# EAGLE design oven (EAGLE 6.1)
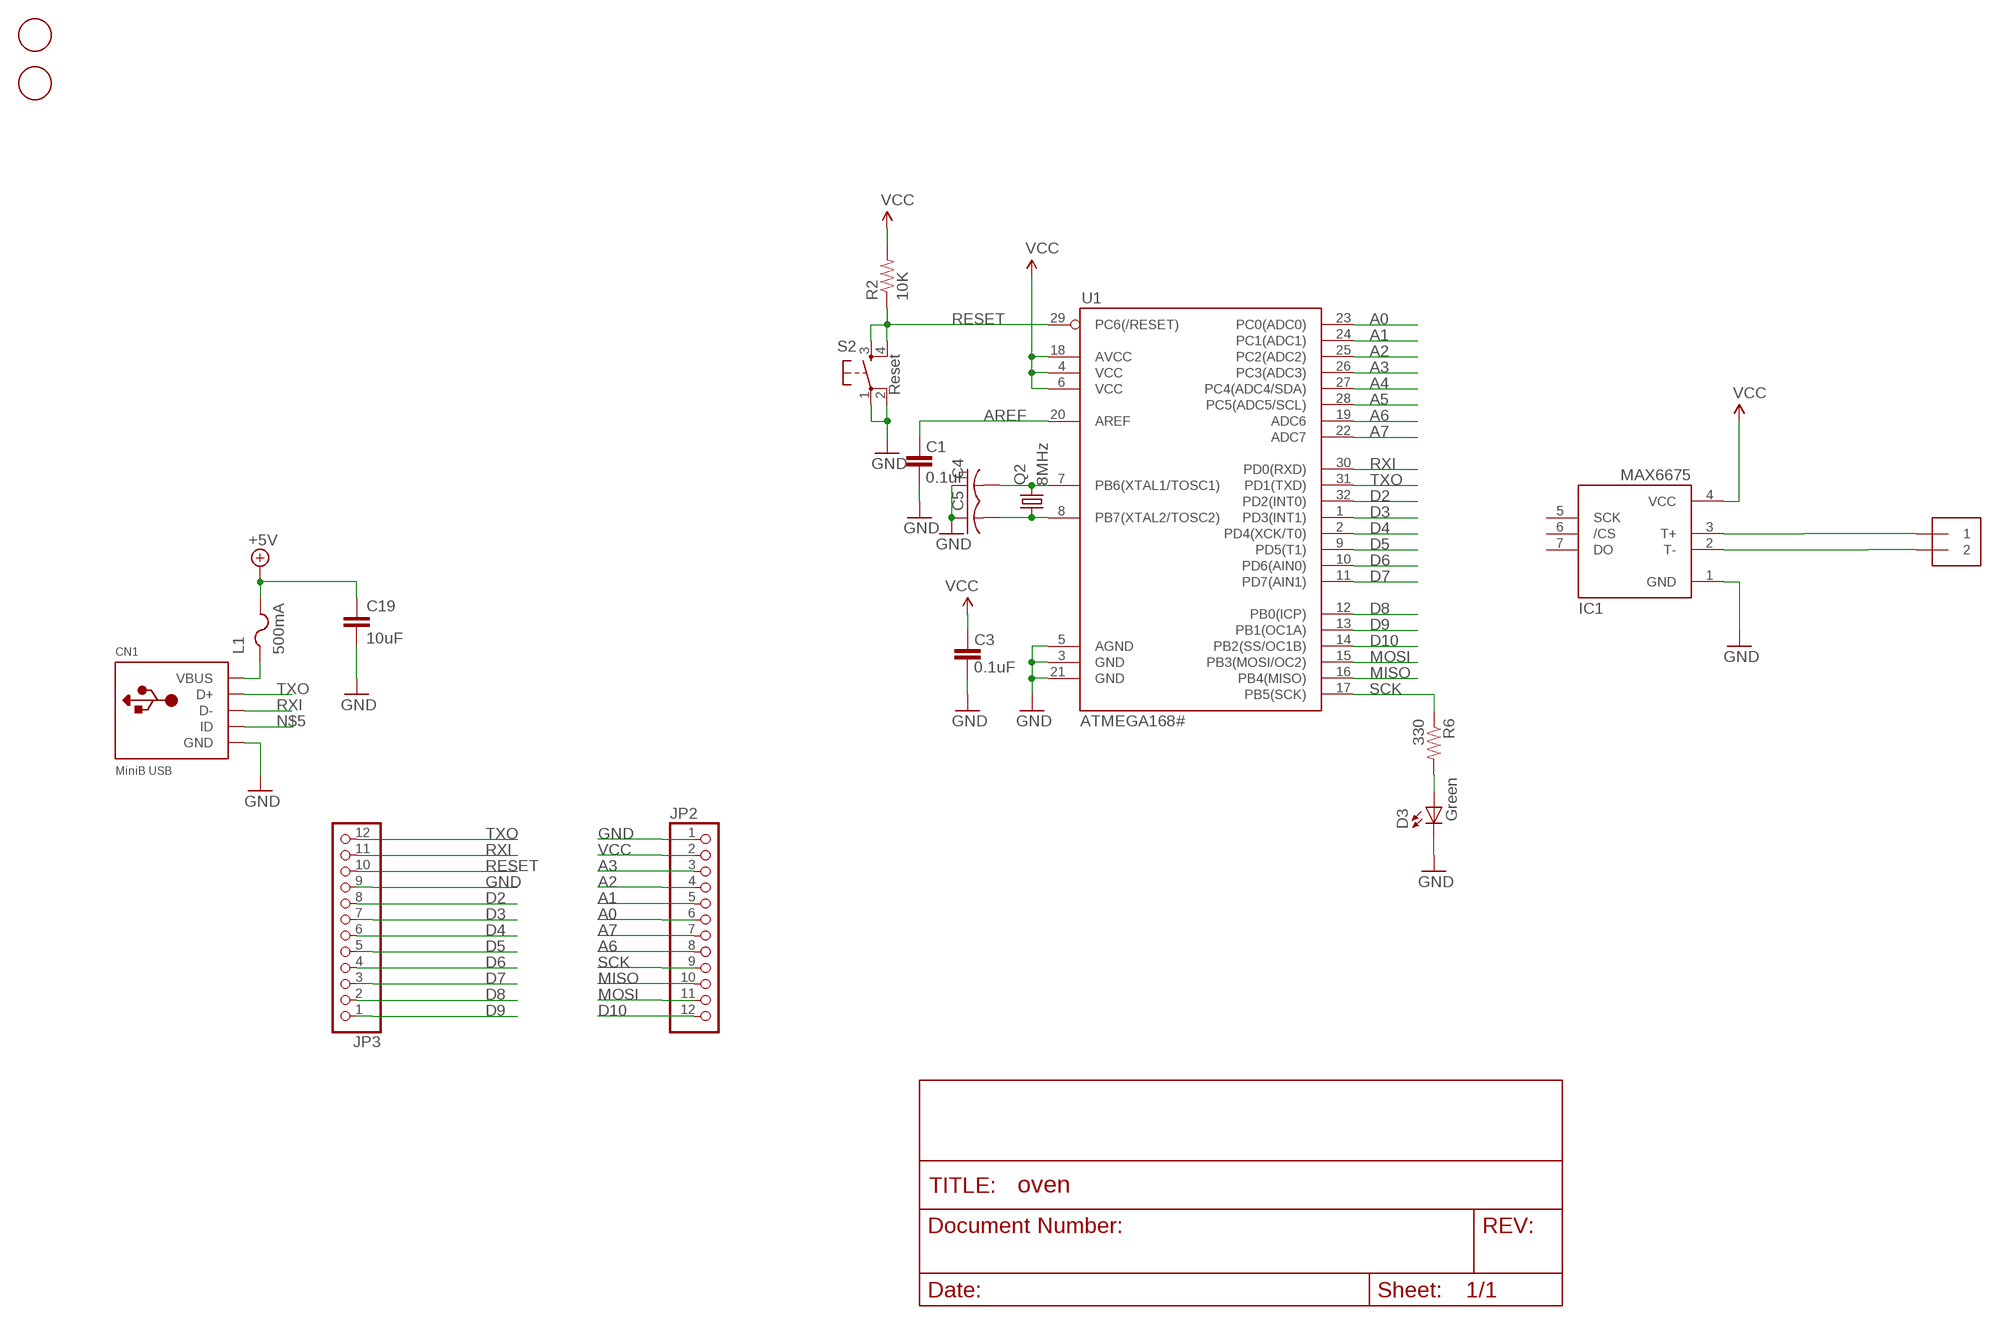
[diagram p0: schematic, sheet 1]

## Parts
C1  0.1uF  CAP0805  [0805]
C3  0.1uF  CAP0805  [0805]
C4  C-USC0805  [C0805]
C5  C-USC0805  [C0805]
C19  10uF  C-EUC1206  [C1206]
CN1  MiniB USB  USBMINIB  [USB-MINIB]
D3  Green  LED0603  [LED-0603]
IC1  MAX6675  [SO08]
J1  1X2-3.5MM  [3.5MMTERM]
JP2  PINHD-1X12  [1X12]
JP3  PINHD-1X12  [1X12]
L1  500mA  PTCFUSE-1206  [R1206]
Q2  8MHz  CRYSTALCTS406  [CTS406]
R2  10K  RESISTOR  [0805]
R6  330  RESISTOR  [0805]
S2  Reset  TAC_SWITCHSMD  [TACTILE_SWITCH_SMD]
U1  ATMEGA168#  ATMEGA168  [TQFP32-08]
U$5  FIDUCIAL  [FIDUCIAL_1MM]
U$6  FIDUCIAL  [FIDUCIAL_1MM]

## Nets
3.3V: IC1.4(VCC) ; supply symbol labelled VCC
A0: JP2.6 U1.23(PC0(ADC0))
A1: JP2.5 U1.24(PC1(ADC1))
A2: JP2.4 U1.25(PC2(ADC2))
A3: JP2.3 U1.26(PC3(ADC3))
A4: U1.27(PC4(ADC4/SDA))
A5: U1.28(PC5(ADC5/SCL))
A6: JP2.8 U1.19(ADC6)
A7: JP2.7 U1.22(ADC7)
AREF: C1.2 U1.20(AREF)
D2: JP3.8 U1.32(PD2(INT0))
D3: JP3.7 U1.1(PD3(INT1))
D4: JP3.6 U1.2(PD4(XCK/T0))
D5: JP3.5 U1.9(PD5(T1))
D6: JP3.4 U1.10(PD6(AIN0))
D7: JP3.3 U1.11(PD7(AIN1))
D8: JP3.2 U1.12(PB0(ICP))
D9: JP3.1 U1.13(PB1(OC1A))
D10: JP2.12 U1.14(PB2(SS/OC1B))
GND: C1.1 C3.1 C4.1 C5.1 C19.2 CN1.GND D3.C IC1.1(GND) JP2.1 JP3.9 S2.1 S2.2 U1.3(GND) U1.5(AGND) U1.21(GND)
GND1: IC1.2(T-) J1.2
MISO: JP2.10 U1.16(PB4(MISO))
MOSI: JP2.11 U1.15(PB3(MOSI/OC2))
N$1: C5.2 Q2.1 U1.8(PB7(XTAL2/TOSC2))
N$2: IC1.3(T+) J1.1
N$3: C4.2 Q2.3 U1.7(PB6(XTAL1/TOSC1))
N$5: CN1.ID
N$7: D3.A R6.2
RESET: JP3.10 R2.1 S2.3 S2.4 U1.29(PC6(/RESET))
RXI: CN1.D- JP3.11 U1.30(PD0(RXD))
SCK: JP2.9 R6.1 U1.17(PB5(SCK))
TXO: CN1.D+ JP3.12 U1.31(PD1(TXD))
VBUS: CN1.VBUS L1.1
VCC: C3.2 C19.1 JP2.2 L1.2 R2.2 U1.4(VCC) U1.6(VCC) U1.18(AVCC) ; supply symbol labelled +5V
Unconnected: IC1.5(SCK) IC1.6(/CS) IC1.7(DO)

## Library data of the parts
C1 C3 = SparkFun:CAP: Capacitor Standard 0603 ceramic capacitor, and 0.1" leaded capacitor.
C4 C5 = rcl:C-US: CAPACITOR, American symbol
C19 = rcl:C-EU: CAPACITOR, European symbol
CN1 = adafruit:USB: USB Connectors USBMINIB - Surface Mount Female Mini-B USB Connector 4UConnector: 06564 By microbuilder.eu Thru-hole RA Female Mini-B USB Connector 4UConnector: 18732 By ladyada.net
D3 = SparkFun:LED: LEDs Standard schematic elements and footprints for 5mm, 3mm, 1206, and 0603 sized LEDs. 5mm - Spark Fun Electronics SKU : COM-00529 (and others)
IC1 = adafruit:MAX6675
J1 = adafruit:1X2: 3.5mm Terminal block http://www.ladyada.net/library/pcb/eaglelibrary.html
JP2 JP3 = pinhead:PINHD-1X12: PIN HEADER
L1 = adafruit:PTCFUSE: PTC fuses, resettable thermistors
Q2 = crystal:CRYSTAL: CRYSTAL; OC_FARNELL: unknown; OC_NEWARK: unknown
R2 R6 = SparkFun:RESISTOR: Resistor Basic schematic elements and footprints for 0603, 1206, and PTH 1/10th watt (small) resistors.
S2 = SparkFun:TAC_SWITCH: Momentary Switch Button commonly used for reset or general input. Spark Fun Electronics SKU : COM-00097
U1 = SparkFun:ATMEGA168
U$5 U$6 = adafruit:FIDUCIAL: For use by pick and place machines to calibrate the vision/machine, 1mm By microbuilder.eu

## Net classes
1 vcc: width 0.254 mm

## Board
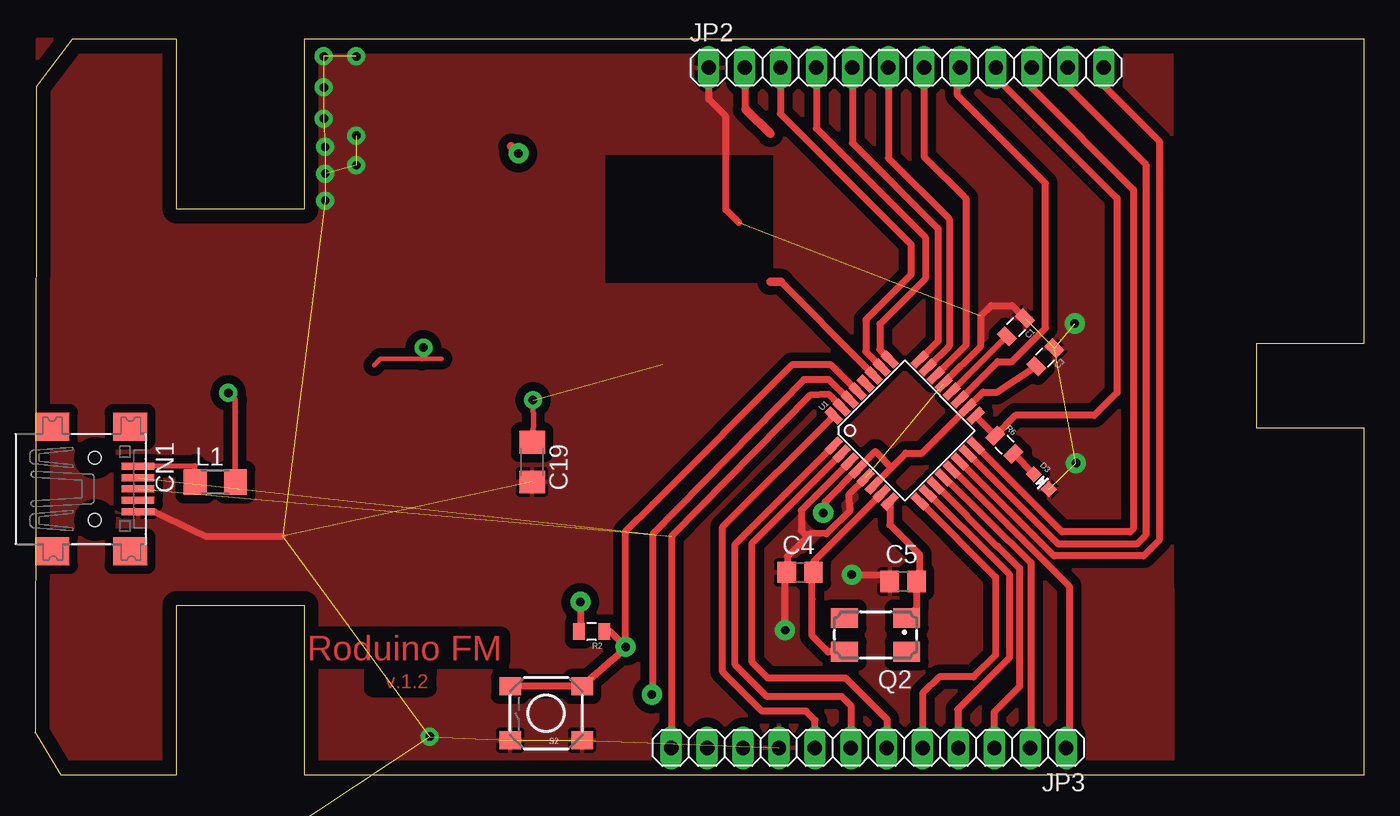
[diagram p1: board, top side]
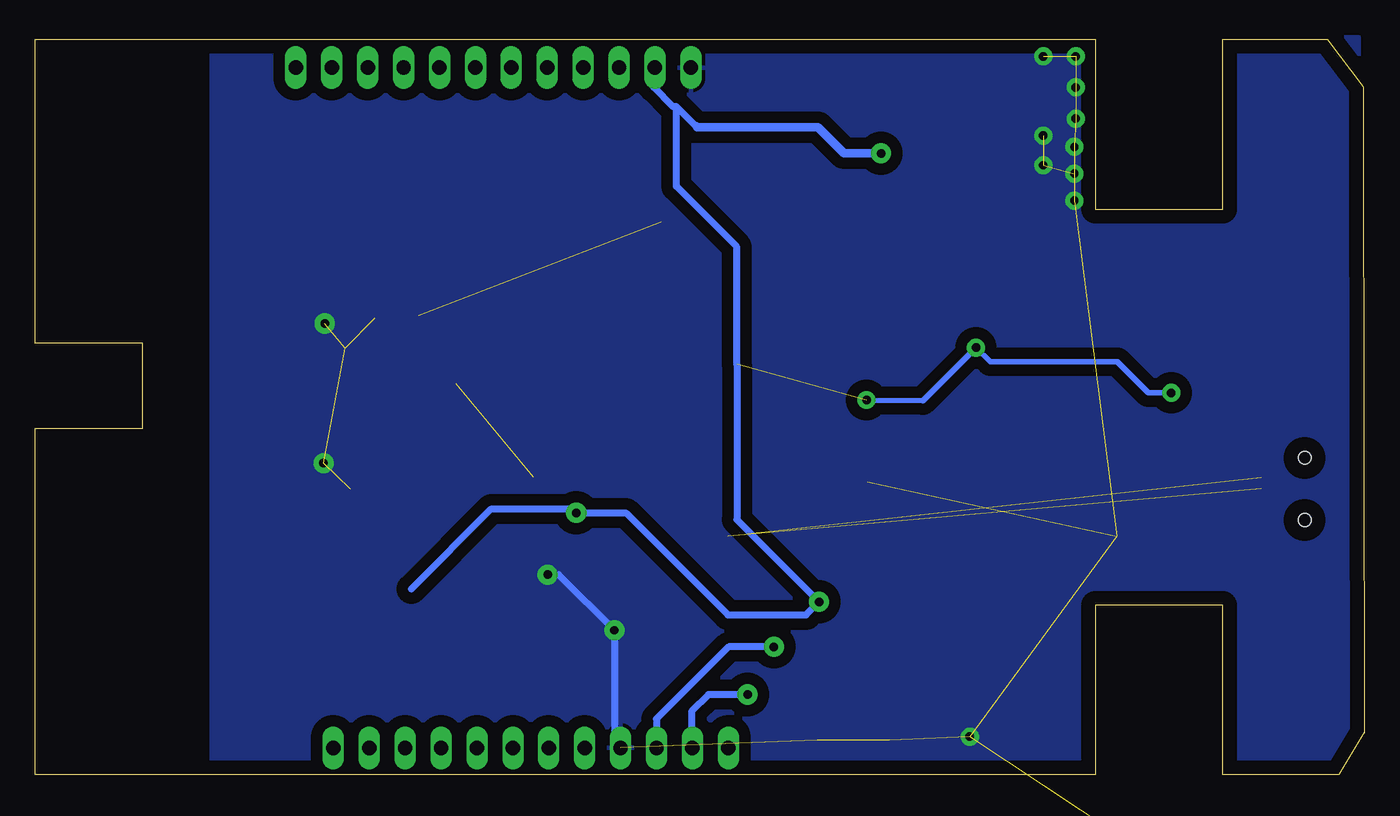
[diagram p2: board, bottom side, seen from below]

Size 94 x 52 mm. Coordinates in mm from the lower left corner, seen from the top.
Outline: 0,3 0.05,45.85 0.05,48.65 2.6,52 10,52 10,40 19,40 19,52 94,52 94,30.5 86.4,30.5 86.4,24.5 94,24.5 94,21.5 94,0 19,0 19,12 10,12 10,0 1.8,0 0,3
Outline: 0,3 0,2.95 0,3
Copper layers (1*16): Top 0.035mm / dielectric 1.5mm / Bottom 0.035mm
Design rules: minimum track width 10mil, minimum drill 24mil, track to track 8mil, track to pad 8mil, pad to pad 8mil, via to via 8mil, smd to smd 8mil, copper to edge 40mil, drill to drill 8mil, minimum pad ring 10mil, minimum via ring 8mil, stop-mask expansion 4mil, vias tented up to drill 0mil, thermal gap 10mil

### Footprints (pad centres in the part's own frame; a part is rotated, then mirrored left to right if it is on the bottom)
0805 = smd 0.8 x 1.2: 1 -0.9,0; 2 0.9,0
C0805 = smd 1.3 x 1.5: 1 -0.95,0; 2 0.95,0
C1206 = smd 1.6 x 1.8: 1 -1.4,0; 2 1.4,0
USB-MINIB = smd 0.5 x 2.308: D+ 0,4.064; D- -0.8,4.064; GND 1.6,4.064; ID 0.8,4.064; VBUS -1.6,4.064 | smd 2 x 2.4: GND1 -4.4,-2; GND2 -4.4,3.5; GND3 4.4,3.5; GND4 4.4,-2 | hole 0.9: -2.2,1; 2.2,1
LED-0603 = smd 0.8 x 0.8: A 0,-0.75; C 0,0.75
SO08 = smd 0.66 x 2.032: 1 -1.905,-3.073; 2 -0.635,-3.073; 3 0.635,-3.073; 4 1.905,-3.073; 5 1.905,3.073; 6 0.635,3.073; 7 -0.635,3.073; 8 -1.905,3.073
3.5MMTERM = drill 1 pad 2.184: 1 1.8,0; 2 -1.7,0
1X12 = drill 1.016 long: 1 -13.97,0; 2 -11.43,0; 3 -8.89,0; 4 -6.35,0; 5 -3.81,0; 6 -1.27,0; 7 1.27,0; 8 3.81,0; 9 6.35,0; 10 8.89,0; 11 11.43,0; 12 13.97,0
R1206 = smd 1.6 x 1.803: 1 -1.422,0; 2 1.422,0
CTS406 = smd 1.9 x 1.4: 1 -2.2,-1.2; 2 2.2,-1.2; 3 2.2,1.2; 4 -2.2,1.2
TACTILE_SWITCH_SMD = smd 1.524 x 1.27: 1 -2.54,1.905; 2 2.54,1.905; 3 -2.54,-1.905; 4 2.54,-1.905
TQFP32-08 = smd 1.27 x 0.559: 1 -4.293,2.8; 2 -4.293,2; 3 -4.293,1.2; 4 -4.293,0.4; 5 -4.293,-0.4; 6 -4.293,-1.2; 7 -4.293,-2; 8 -4.293,-2.8; 17 4.293,-2.8; 18 4.293,-2; 19 4.293,-1.2; 20 4.293,-0.4; 21 4.293,0.4; 22 4.293,1.2; 23 4.293,2; 24 4.293,2.8 | smd 0.559 x 1.27: 9 -2.8,-4.293; 10 -2,-4.293; 11 -1.2,-4.293; 12 -0.4,-4.293; 13 0.4,-4.293; 14 1.2,-4.293; 15 2,-4.293; 16 2.8,-4.293; 25 2.8,4.293; 26 2,4.293; 27 1.2,4.293; 28 0.4,4.293; 29 -0.4,4.293; 30 -1.2,4.293; 31 -2,4.293; 32 -2.8,4.293
FIDUCIAL_1MM = smd 1 x 1: 1 0,0

### Placement (x,y rotation side)
C1  69.37,31.65 225 top
C3  71.45,29.51 225 top
C4  54.1,14.31 0 top
C5  61.39,13.67 0 top
C19  35.14,22.11 270 top
CN1  3.2,20.21 270 top
D3  71.16,20.72 225 top
IC1  1,-13.3 0 top  (outside the outline)
J1  -0.15,-25.2 0 top  (outside the outline)
JP2  61.6,50 0 top
JP3  58.95,1.9 180 top
L1  12.73,20.69 0 top
Q2  59.44,9.89 180 top
R2  39.35,10.13 180 top
R6  68.56,23.35 315 top
S2  36.14,4.35 180 top
U1  61.5,24.34 45 top
U$5  -2.55,-18.6 0 top  (outside the outline)
U$6  -0.4,-18.6 0 top  (outside the outline)

### Tracks (layer width: path | path; a pad name or v marks a point on that pad's centre or on a via)
A0
  Top 0.508: U1.23 64.65,30.32 64.65,39.3 60.33,43.62 JP2.6
A1
  Top 0.508: U1.24 63.86,30.66 63.86,38.62 57.79,44.69 JP2.5
A2
  Top 0.508: U1.25 59.75,30.06 59.75,31.86 62.95,35.06 62.95,38.01 55.25,45.7 55.25,45.71 JP2.4
A3
  Top 0.508: U1.26 58.76,29.92 58.76,32.16 61.96,35.37 61.96,37.5 52.71,46.75 JP2.3
A4
  Top 0.5: U1.27 58.56,28.99 52.75,34.85
  Top 0.61: 52.75,34.85 51.99,34.85
A6
  Top 0.508: U1.19 68.08,29.22 69.09,29.22 71.45,31.58 71.45,41.82 65.23,48.04 65.23,49.84 65.25,49.84 JP2.8
A7
  Top 0.508: U1.22 65.82,30.36 65.82,40.75 62.87,43.7 JP2.7
AREF
  Top 0.406: 64.82,27.13 64.85,27.13 C1.2
  Top 0.508: U1.20 64.82,27.13
D2
  Top 0.406: 55.14,3.84 55.16,3.86
  Top 0.508: 55.16,3.86 54.51,4.5 51.39,4.5 48.62,7.27 48.62,17.53 U1.32 | JP3.8 55.14,3.84
D3
  Top 0.508: U1.1 49.51,16.31 49.51,7.78 51.77,5.52 57.05,5.52 57.7,4.87 57.7,1.92 JP3.7
D4
  Top 0.508: U1.2 50.7,16.37 50.7,7.96 51.82,6.84 57.33,6.84 60.24,3.93 60.24,1.92 JP3.6
D5
  Top 0.508: U1.9 62.58,19.33 67.92,13.98 67.92,8.47 66.38,6.92 63.94,6.92 62.77,5.75 JP3.5
D6
  Top 0.508: U1.10 63.15,19.89 65.51,17.53 65.54,17.53 68.89,14.18 68.89,8.26 65.26,4.63 65.26,1.94 JP3.4
D7
  Top 0.508: U1.11 63.73,20.46 68.05,16.14 68.1,16.14 69.63,14.61 69.63,6.23 67.82,4.43 67.82,1.92 JP3.3
D8
  Top 0.508: U1.12 64.31,21.02 70.44,14.99 70.44,1.96 JP3.2
D9
  Top 0.508: U1.13 64.89,21.59 73.13,13.34 73.13,2.11 JP3.1
D10
  Top 0.508: U1.14 72.06,15.48 78.42,15.48 79.51,16.57 79.51,44.81 75.57,48.75 JP2.12
GND  (via drill 0.6 pad 1.27, 0.6 pad 1.42)  (21 unrouted)
  Top 0.5: 49.75,39.05 48.85,39.95 | CN1.GND 8.44,18.61 12.05,16.85 17.49,16.85
  Top 0.508: U1.5 58.75,20.98 58.72,20.98 57.54,19.8 57.61,18.68 55.96,17.03 54.84,17.08 54.6,16.84 | 54.6,16.84 53.19,15.43 53.19,14.36 C4.1 53.04,14.21 v53.04,10.22 | U1.3 57.62,22.14 54.18,18.7 54.18,17.25 54.6,16.84 | U1.21 64.25,27.68 66.88,30.31 66.88,32.44 67.62,33.18 69.11,33.18 C1.1 | v57.77,14.16 59.95,14.16 C5.1 | 48.85,39.95 48.85,46.55 47.65,47.75 47.65,49.98 JP2.1
  Bottom 0.508: v57.77,14.16 56.98,14.16 v53.04,10.22 53.04,2.34 JP3.9
  other vias: 73.61,22.03 73.53,31.91 20.4,50.8 20.4,48.6 20.4,46.4 20.5,44.4 20.5,42.5 20.5,40.6 22.7,50.8 22.7,45.2 22.7,43.1 27.9,2.7
  pour Bottom (isolate 0.813): 0.38,52.16 0.38,0.38 10.05,0.38 10.05,12 18.95,12 18.95,0.2 81.52,0.23 81.51,52.01 19.05,52.05 19.05,40.25 18.95,40.25 18.95,40.05 10.05,40.05 10.05,52.16
  pour Top (isolate 0.61): 0.18,51.96 0.38,0.38 10.05,0.38 10.05,12.1 18.95,12.1 18.95,0.25 80.44,0.33 80.36,51.99 40.35,52.1 40.35,44.7 40.3,44.7 40.3,44 52.35,44 52.35,34.85 52.4,34.85 52.4,34.6 40.15,34.6 40.15,52.05 18.95,52.05 18.95,40.1 10.05,40.1 10.05,51.96
GND1  (1 unrouted)
MISO
  Top 0.508: U1.16 72.62,17.18 77.45,17.18 77.68,17.41 77.68,41.38 70.49,48.57 70.49,48.58 JP2.10
MOSI
  Top 0.508: U1.15 72.36,16.32 77.93,16.32 78.54,16.92 78.54,43.16 73.03,48.68 JP2.11
N$1
  Top 0.508: U1.8 60.45,17.67 62.54,15.58 62.54,13.87 C5.2 62.34,11.79 Q2.1
N$2  (1 unrouted)
N$3
  Top 0.508: Q2.3 56.07,8.69 54.95,9.81 54.95,12.43 54.95,14.21 C4.2 55.05,15.06 U1.7
N$7
  Top 0.508: R6.2 69.22,22.71 D3.A
RESET  (via drill 0.6 pad 1.42)
  Top 0.508: S2.4 S2.3 41.83,8.99 v41.76,9.05 | U1.29 56.29,28.99 53.52,28.99 43.64,19.11 41.76,17.23 v41.76,9.05 | R2.1 40.68,10.13 v41.76,9.05
  Bottom 0.508: v41.76,9.05 44.96,9.05 50.07,3.94 JP3.10
RXI  (via drill 0.6 pad 1.42)  (1 unrouted)
  Top 0.508: U1.30 57.58,26.53 56.14,27.95 54.36,27.95 43.67,17 43.67,5.72 v43.62,5.67
  Bottom 0.508: v43.62,5.67 46.38,5.67 47.58,4.48 47.58,1.96 JP3.11
SCK
  Top 0.508: U1.17 66.52,25.39 R6.1 69.34,25.41 74.91,25.41 76.51,27.01 76.51,40.77 67.95,49.34 JP2.9
TXO  (1 unrouted)
  Top 0.508: U1.31 56.14,26.91 54.79,26.83 45.01,16.87 45.01,1.93 JP3.12
VBUS
  Top 0.406: CN1.VBUS 11.29,21.86 L1.1
VCC  (via drill 0.6 pad 1.27, 0.6 pad 1.42)  (1 unrouted)
  Top 0.305: 23.97,28.97 24.4,29.4 27.35,29.4 28.75,29.4
  Top 0.406: L1.2 14.15,26.5 v13.65,27 | v27.45,30.2 27.45,29.5 27.35,29.4 | C19.1 35.24,24.76 v35.2,26.5
  Top 0.5: 33.85,43.62 v34.17,43.94
  Top 0.508: C3.2 68.03,27.06 67.04,27.06 65.95,25.97 U1.18 62.73,22.74 61.58,22.74 59.31,20.48 U1.6 60.56,21.7 60.56,21.73 59.42,22.87 58.18,21.64 U1.4 58.16,21.59 55.88,19.31 55.88,18.68 v55.73,18.52 | v38.56,12.22 38.56,10.24 R2.2 | 50.25,47.05 50.25,49.92 JP2.2
  Top 0.61: 33.67,44.44 v34.17,43.94 | 51.99,45.31 50.25,47.05
  Bottom 0.406: v13.65,27 15.25,27 17.45,29.2 26.45,29.2 v27.45,30.2 31.2,26.45 v35.2,26.5
  Bottom 0.5: 67.4,13.15 61.75,18.8 56.01,18.8 v55.73,18.52
  Bottom 0.508: v55.73,18.52 52.23,18.52 45.01,11.31 39.48,11.31 v38.56,12.22 44.38,18.04 44.38,29.02 44.38,37.33 48.65,41.6 48.65,47.25 | 47.2,45.8 47.2,45.9 47.3,45.9 48.65,47.25 | 50.2,49.97 JP2.2 50.25,49.92 50.25,48.6 48.9,47.25 48.65,47.25
  Bottom 0.61: v34.17,43.94 36.79,43.94 38.65,45.8 47.2,45.8

### Text on the board
Top: Roduino FM | v.1.2
tDocu: SPKR_B_P | SPKR_A_P | GND | GND | VCC | A3 | A2 | A1 | A0 | A7 | A6 | SCK | MISO | MOSI | D10 | VCC | VCC | GND | GND | TXO | RXI | RESET | GND | D2 | D3 | D4 | D5 | D6 | D7 | D8 | D9